# EasyEDA schematic SCH_micro65_2023-10-09.json
TITLE: Micro65; REV: 0.7; Date: 2023-10-05; Sheet: 1/1; Drawn By: wynnfarr62; Company: Wynn Makes Things
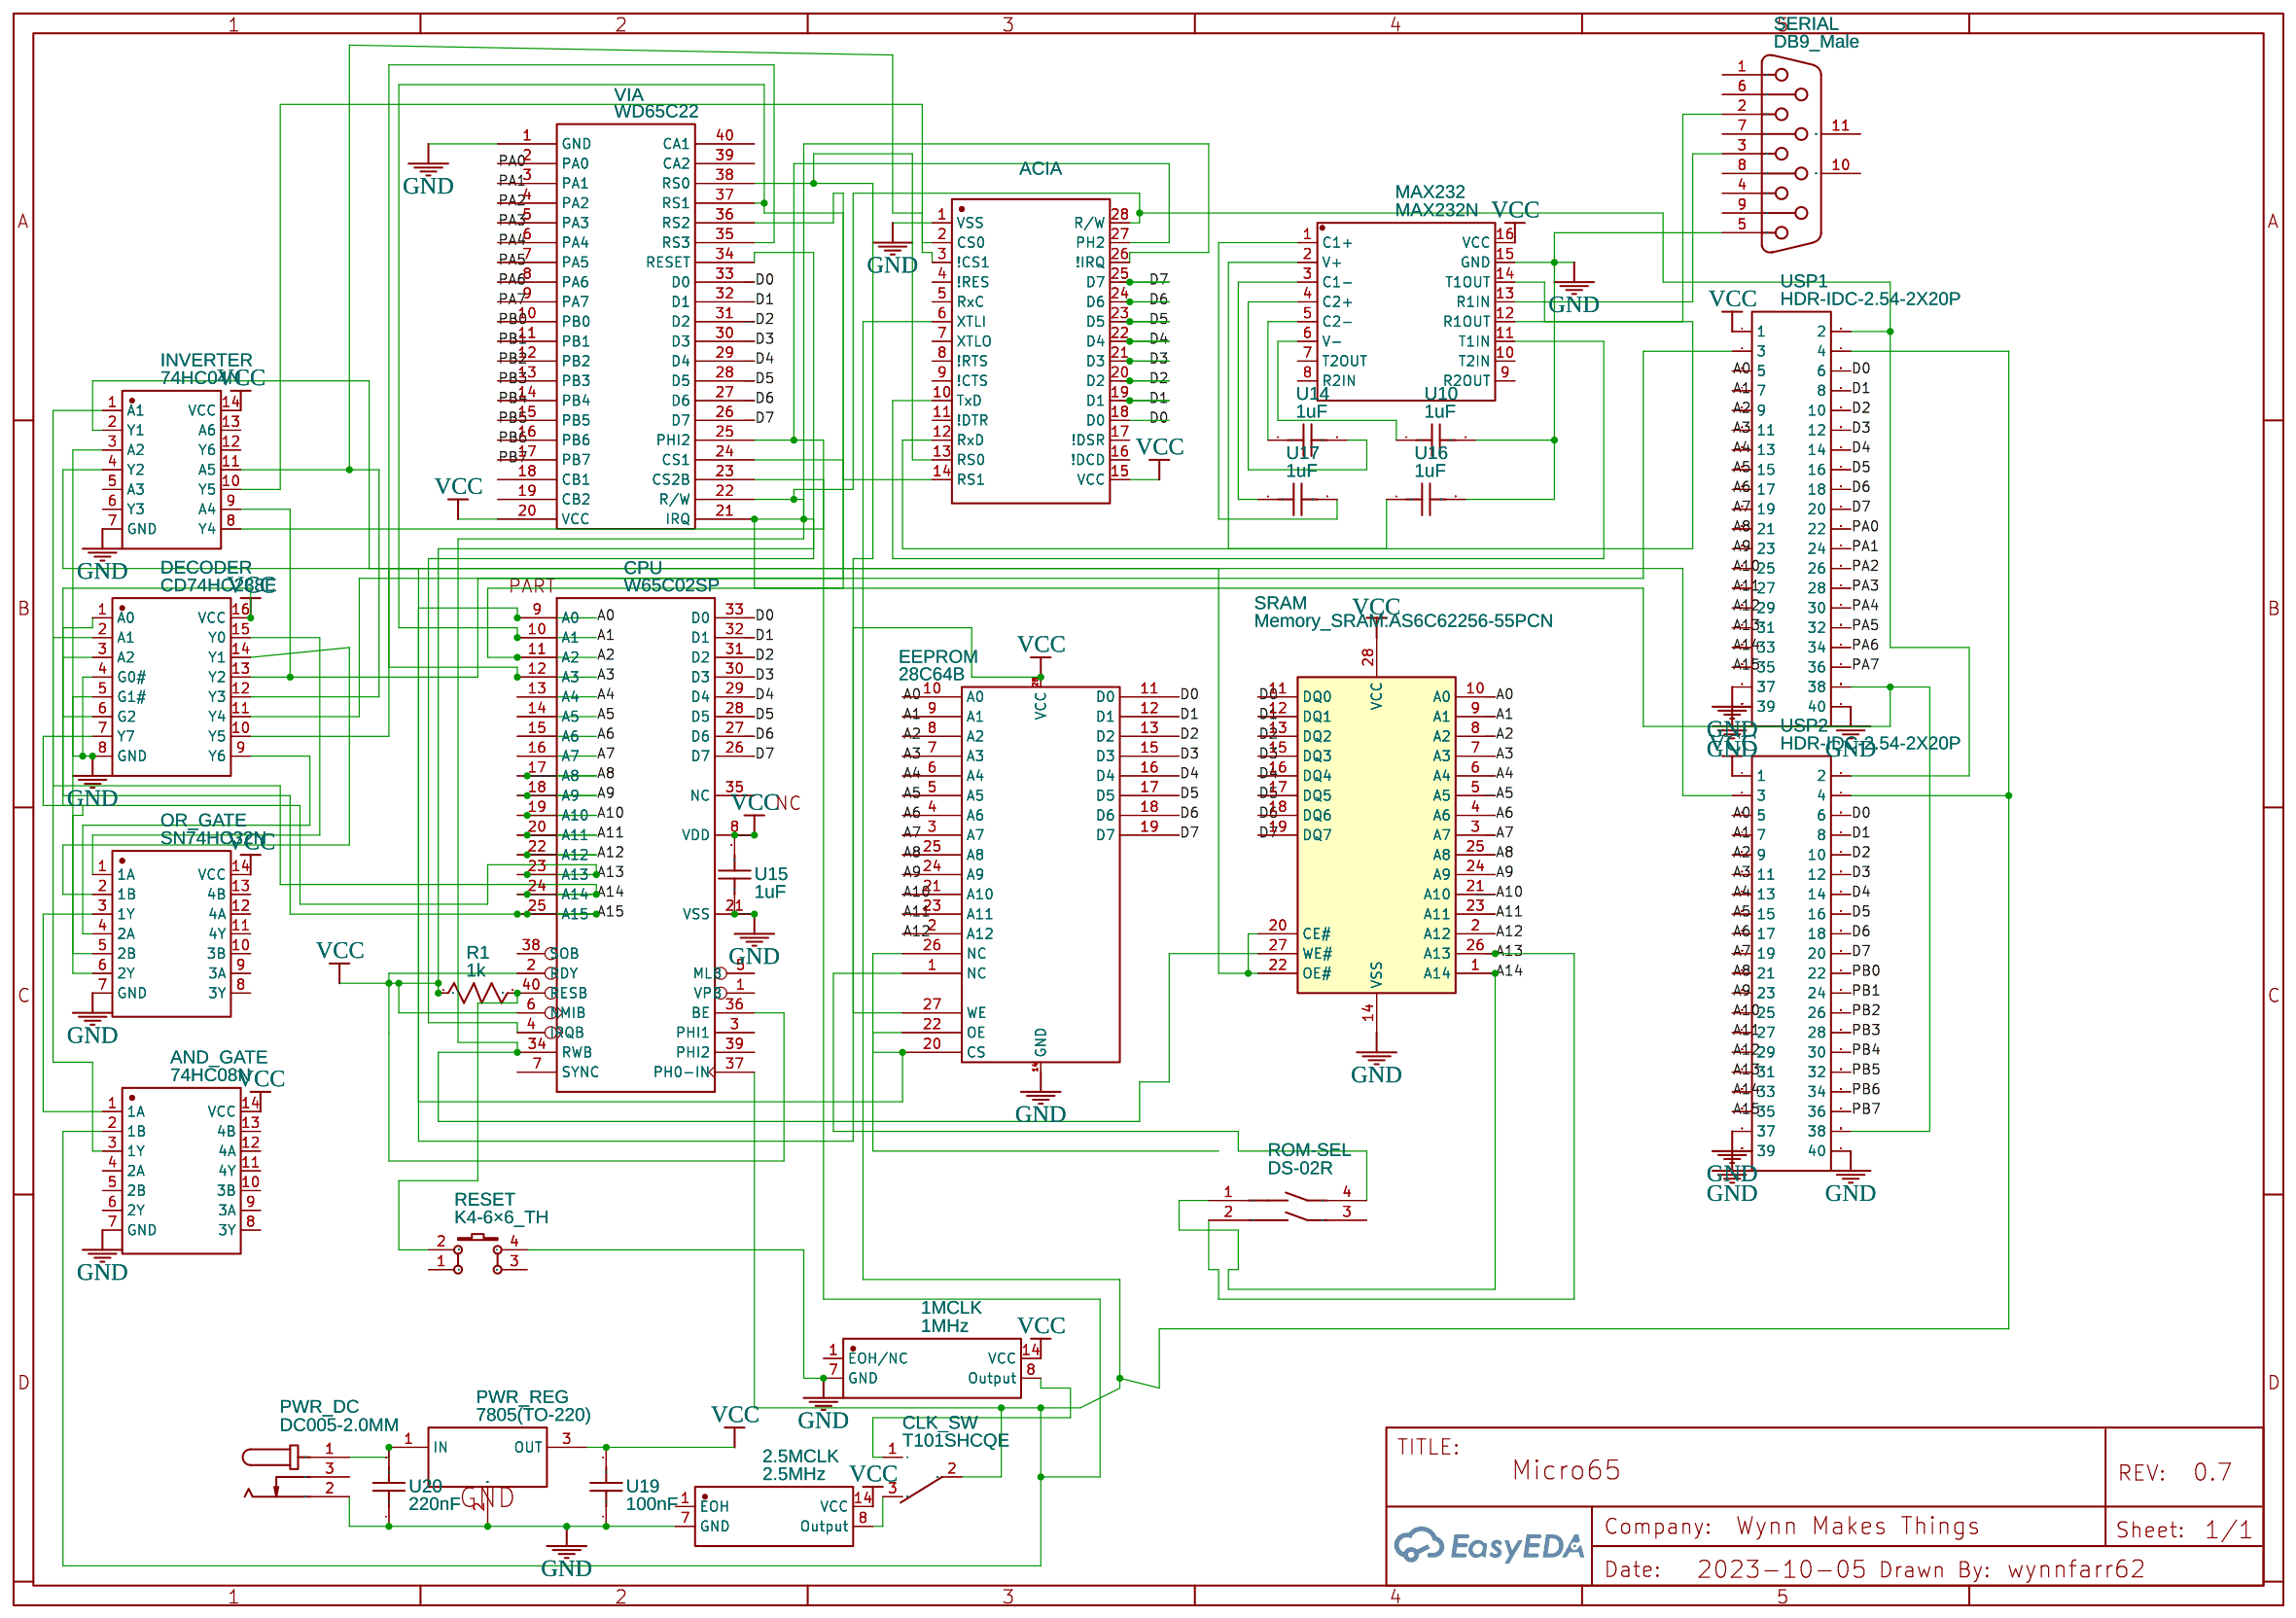
[diagram p0: schematic sheet]

## Parts
1MCLK  1MHz  [OSC-TH_4P-L20.8-W13.2-P15.24-BL]
2.5MCLK  2.5MHz  [OSC-TH_4P-L20.8-W13.2-P15.24-BL]
ACIA  NO  [DIP-28_L36.8-W13.9-P2.54-LS15.2-BL]
AND_GATE  74HC08N  [PDIP-14_L19.3-W6.5-P2.54-LS7.6-BL]
CLK_SW  T101SHCQE  [SW-TH_T101SHCQE]
CPU  W65C02SP  [DIP-40_L52.3-W13.9-P2.54-LS15.2-BL-BASE]
DECODER  CD74HC238E  [PDIP-16_L19.3-W6.4-P2.54-LS7.9-BL]
EEPROM  28C64B  [DIP-28_L36.8-W13.9-P2.54-LS15.2-BL]
INVERTER  74HC04N  [DIP-14_L19.4-W6.4-P2.54-LS7.6-BL]
MAX232  MAX232N  [PDIP-16_L19.7-W6.6-P2.54-LS7.8-BL]
OR_GATE  SN74HC32N  [DIP-14_L19.0-W7.0-P2.54-LS7.6-BL]
PWR_DC  DC005-2.0MM  [DC-IN-TH_DC005]
PWR_REG  7805(TO-220)  [TO-220-3_L10.0-W4.5-P2.54-L]
R1  1k  [R_AXIAL-0.3]
RESET  K4-6×6_TH  [KEY-TH_4P-L6.0-W6.0-P4.50-LS6.5]
ROM-SEL  DS-02R  [SW-TH_4P-P2.54_DS-02R]
SERIAL  DB9_Male  [DSUB-TH_DMR-9P]
SRAM  Memory_SRAM:AS6C62256-55PCN  [DIP-28_L36.8-W13.9-P2.54-LS15.2-BL]
U10  1uF  [CAP-TH_L4.0-W2.5-P5.00-D0.5]
U14  1uF  [CAP-TH_L4.0-W2.5-P5.00-D0.5]
U15  1uF  [CAP-TH_L4.0-W2.5-P5.00-D0.5]
U16  1uF  [CAP-TH_L4.0-W2.5-P5.00-D0.5]
U17  1uF  [CAP-TH_L4.0-W2.5-P5.00-D0.5]
U19  100nF  [CAP-TH_L7.2-W2.5-P5.00-D1.0]
U20  220nF  [CAP-TH_L7.2-W2.5-P5.00-D0.5]
USP1  HDR-IDC-2.54-2X20P  [IDC-TH_40P-P2.54_C9138]
USP2  HDR-IDC-2.54-2X20P  [IDC-TH_40P-P2.54_C9138]
VIA  WD65C22  [DIP-40_L52.3-W13.9-P2.54-LS15.2-BL-BASE]

## Library data of the parts
1MCLK = MXO45T-2C-1M000000: Contributor: lcsc; Supplier: LCSC; Supplier Part: C1138959; Manufacturer: CTS(西迪斯); JLCPCB Part Class: Extended Part; link: https://lcsc.com/eda_search?q=C1138959&%26type=1&ref=editor
2.5MCLK = MXO45HST-2I-2M500000: Contributor: lcsc; Supplier: LCSC; Supplier Part: C1138640; Manufacturer: CTS(西迪斯); JLCPCB Part Class: Extended Part; link: https://lcsc.com/eda_search?q=C1138640&%26type=1&ref=editor
ACIA = R6551
AND_GATE = 74HC08N: Contributor: lcsc; Supplier: LCSC; Supplier Part: C5116331; Manufacturer: HGSEMI(华冠); link: https://lcsc.com/eda_search?q=C5116331&%26type=1&ref=editor
CLK_SW = T101SHCQE: Contributor: LCSC; Supplier: LCSC; Supplier Part: C221979; Manufacturer: C&K; JLCPCB Part Class: Extended Part; link: https://lcsc.com/eda_search?q=C221979&%26type=1&ref=editor
DECODER = CD74HC238E: Contributor: LCSC; Supplier: LCSC; Supplier Part: C1547095; Manufacturer: TI(德州仪器); JLCPCB Part Class: Extended Part; link: https://lcsc.com/eda_search?q=C1547095&%26type=1&ref=editor
EEPROM = -: Contributor: KiCAD; license: https://www.gnu.org/licenses/lgpl-2.1.html; Package Display: No
INVERTER = 74HC04N: Contributor: LCSC; Supplier: LCSC; Supplier Part: C507192; Manufacturer: HGSEMI(华冠); JLCPCB Part Class: Extended Part; link: https://lcsc.com/eda_search?q=C507192&%26type=1&ref=editor
MAX232 = MAX232N: Contributor: LCSC; Supplier: LCSC; Supplier Part: C353147; Manufacturer: Texas Instruments; JLCPCB Part Class: Extended Part; link: https://lcsc.com/eda_search?q=C353147&%26type=1&ref=editor
OR_GATE = SN74HC32N: Supplier: LCSC; Manufacturer: TI(德州仪器); Supplier Part: C2894; JLCPCB Part Class: Extended Part; link: https://lcsc.com/eda_search?q=C2894&%26type=1&ref=editor
PWR_DC = DC005-2.0MM: Supplier: LCSC; Manufacturer: SOFNG; Supplier Part: C111567
PWR_REG = 7805(TO-220): Supplier: LCSC; Manufacturer: STMicroelectronics; Manufacturer Part: L7805CV-DG; Supplier Part: C3795; Contributor: LCEDA_Lib
R1 = R_AXIAL-0.3_US: Contributor: LCEDA_Lib
RESET = K4-6×6_TH: Supplier: LCSC; Supplier Part: C136684; Manufacturer: 韩国韩荣; Manufacturer Part: K2-1102DP-E4SW-04; Contributor: LCEDA_Lib
ROM-SEL = DS-02R: Contributor: lcsc; Supplier: LCSC; Supplier Part: C2985910; Manufacturer: SM Switch; link: https://lcsc.com/eda_search?q=C2985910&%26type=1&ref=editor
SERIAL = DB9_Male: Supplier Part: C185657; Supplier: LCSC; Manufacturer: Amphenol; Contributor: LCEDA_Lib
SRAM = -: Contributor: P Garrity
U10 U14-U17 = FK28X5R1E105KR000: Contributor: lcsc; Supplier: LCSC; Supplier Part: C3695773; Manufacturer: TDK; link: https://lcsc.com/eda_search?q=C3695773&%26type=1&ref=editor
U19 = MEB104J63V82CB0236: Contributor: lcsc; Supplier: LCSC; Supplier Part: C3034535; Manufacturer: KNSCHA(科尼盛); link: https://lcsc.com/eda_search?q=C3034535&%26type=1&ref=editor
U20 = C242A224J20C000: Contributor: lcsc; Supplier: LCSC; Supplier Part: C5121934; Manufacturer: faratronic(厦门法拉); link: https://lcsc.com/eda_search?q=C5121934&%26type=1&ref=editor
USP1 USP2 = HDR-IDC-2.54-2X20P: Supplier: LCSC; Manufacturer: BOOMELE; Manufacturer Part: IDC Box 2X20 2.54MM; image: //image.lceda.cn/szlcsc/C9138.jpg; Supplier Part: C9138
VIA = -: Contributor: Guki

## Nets
GND: 1MCLK.7(GND) 2.5MCLK.7(GND) ACIA.1(VSS) AND_GATE.7(GND) CPU.21(VSS) DECODER.4(G0#) DECODER.5(G1#) DECODER.8(GND) EEPROM.14(GND) INVERTER.7(GND) MAX232.15(GND) OR_GATE.7(GND) PWR_DC.2 PWR_REG.2(GND) RESET.4 SERIAL.5 SRAM.14(VSS) U10.2 U15.1 U16.2 U19.1 U20.1 USP1.37 USP1.39 USP1.40 USP2.37 USP2.39 USP2.40 VIA.1(GND)
VCC: 1MCLK.14(VCC) 2.5MCLK.14(VCC) ACIA.15(VCC) AND_GATE.14(VCC) CPU.2(RDY) CPU.6(NMIB) CPU.8(VDD) CPU.36(BE) DECODER.6(G2) DECODER.16(VCC) EEPROM.27(WE) EEPROM.28(VCC) INVERTER.14(VCC) MAX232.16(VCC) OR_GATE.14(VCC) PWR_REG.3(OUT) R1.1 SRAM.28(VCC) U15.2 U19.2 USP1.1 USP2.1 VIA.20(VCC) VIA.34(RESET)
A0: ACIA.13(RS0) CPU.9(A0) EEPROM.10(A0) SRAM.10(A0) USP1.5 USP2.5 VIA.38(RS0)
A1: ACIA.14(RS1) CPU.10(A1) EEPROM.9(A1) SRAM.9(A1) USP1.7 USP2.7 VIA.37(RS1)
A2: CPU.11(A2) EEPROM.8(A2) SRAM.8(A2) USP1.9 USP2.9 VIA.36(RS2)
A3: CPU.12(A3) EEPROM.7(A3) SRAM.7(A3) USP1.11 USP2.11 VIA.35(RS3)
A4: CPU.13(A4) EEPROM.6(A4) SRAM.6(A4) USP1.13 USP2.13
A5: CPU.14(A5) EEPROM.5(A5) SRAM.5(A5) USP1.15 USP2.15
A6: CPU.15(A6) EEPROM.4(A6) SRAM.4(A6) USP1.17 USP2.17
A7: CPU.16(A7) EEPROM.3(A7) SRAM.3(A7) USP1.19 USP2.19
A8: CPU.17(A8) EEPROM.25(A8) SRAM.25(A8) USP1.21 USP2.21
A9: CPU.18(A9) EEPROM.24(A9) SRAM.24(A9) USP1.23 USP2.23
A10: CPU.19(A10) EEPROM.21(A10) SRAM.21(A10) USP1.25 USP2.25
A11: CPU.20(A11) EEPROM.23(A11) SRAM.23(A11) USP1.27 USP2.27
A12: CPU.22(A12) EEPROM.2(A12) SRAM.2(A12) USP1.29 USP2.29
A13: CPU.23(A13) DECODER.1(A0) ROM-SEL.2 SRAM.26(A13) USP1.31 USP2.31
A14: CPU.24(A14) DECODER.2(A1) ROM-SEL.1 SRAM.1(A14) USP1.33 USP2.33
A15: CPU.25(A15) DECODER.3(A2) USP1.35 USP2.35
D0: ACIA.18(D0) CPU.33(D0) EEPROM.11(D0) SRAM.11(DQ0) USP1.6 USP2.6 VIA.33(D0)
D1: ACIA.19(D1) CPU.32(D1) EEPROM.12(D1) SRAM.12(DQ1) USP1.8 USP2.8 VIA.32(D1)
D2: ACIA.20(D2) CPU.31(D2) EEPROM.13(D2) SRAM.13(DQ2) USP1.10 USP2.10 VIA.31(D2)
D3: ACIA.21(D3) CPU.30(D3) EEPROM.15(D3) SRAM.15(DQ3) USP1.12 USP2.12 VIA.30(D3)
D4: ACIA.22(D4) CPU.29(D4) EEPROM.16(D4) SRAM.16(DQ4) USP1.14 USP2.14 VIA.29(D4)
D5: ACIA.23(D5) CPU.28(D5) EEPROM.17(D5) SRAM.17(DQ5) USP1.16 USP2.16 VIA.28(D5)
D6: ACIA.24(D6) CPU.27(D6) EEPROM.18(D6) SRAM.18(DQ6) USP1.18 USP2.18 VIA.27(D6)
D7: ACIA.25(D7) CPU.26(D7) EEPROM.19(D7) SRAM.19(DQ7) USP1.20 USP2.20 VIA.26(D7)
PA0: USP1.22 VIA.2(PA0)
PA1: USP1.24 VIA.3(PA1)
PA2: USP1.26 VIA.4(PA2)
PA3: USP1.28 VIA.5(PA3)
PA4: USP1.30 VIA.6(PA4)
PA5: USP1.32 VIA.7(PA5)
PA6: USP1.34 VIA.8(PA6)
PA7: USP1.36 VIA.9(PA7)
PB0: USP2.22 VIA.10(PB0)
PB1: USP2.24 VIA.11(PB1)
PB2: USP2.26 VIA.12(PB2)
PB3: USP2.28 VIA.13(PB3)
PB4: USP2.30 VIA.14(PB4)
PB5: USP2.32 VIA.15(PB5)
PB6: USP2.34 VIA.16(PB6)
PB7: USP2.36 VIA.17(PB7)
Net-(1MCLK-8): 1MCLK.8(Output) CLK_SW.1
Net-(2.5MCLK-8): 2.5MCLK.8(Output) CLK_SW.3
Net-(ACIA-2): ACIA.2(CS0) DECODER.12(Y3) INVERTER.11(A5)
Net-(ACIA-3): ACIA.3(!CS1) INVERTER.10(Y5)
Net-(ACIA-6): ACIA.6(XTLI) ACIA.27(PH2) AND_GATE.2(1B) CLK_SW.2 CPU.37(PH0-IN) USP1.4 USP2.4 VIA.25(PHI2)
Net-(ACIA-10): ACIA.10(TxD) MAX232.11(T1IN)
Net-(ACIA-12): ACIA.12(RxD) MAX232.12(R1OUT)
Net-(ACIA-26): ACIA.26(!IRQ) ACIA.28(R/W) CPU.4(IRQB) CPU.34(RWB) SRAM.27(WE#) USP1.2 USP1.38 USP2.2 USP2.38 VIA.21(IRQ) VIA.22(R/W)
Net-(AND_GATE-1): AND_GATE.1(1A) OR_GATE.3(1Y)
Net-(AND_GATE-3): AND_GATE.3(1Y) INVERTER.1(A1)
Net-(CPU-40): CPU.40(RESB) R1.2 RESET.2
Net-(DECODER-7): DECODER.7(Y7) OR_GATE.5(2B)
Net-(DECODER-9): DECODER.9(Y6) OR_GATE.4(2A)
Net-(DECODER-10): DECODER.10(Y5) USP2.3
Net-(DECODER-11): DECODER.11(Y4) USP1.3
Net-(DECODER-13): DECODER.13(Y2) INVERTER.9(A4) VIA.24(CS1)
Net-(DECODER-14): DECODER.14(Y1) OR_GATE.2(1B)
Net-(DECODER-15): DECODER.15(Y0) OR_GATE.1(1A)
Net-(EEPROM-1): EEPROM.1(NC) ROM-SEL.4
Net-(EEPROM-20): EEPROM.20(CS) EEPROM.22(OE) INVERTER.4(Y2)
Net-(INVERTER-2): INVERTER.2(Y1) SRAM.20(CE#) SRAM.22(OE#)
Net-(INVERTER-3): INVERTER.3(A2) OR_GATE.6(2Y)
Net-(INVERTER-8): INVERTER.8(Y4) VIA.23(CS2B)
Net-(MAX232-1): MAX232.1(C1+) U17.2
Net-(MAX232-2): MAX232.2(V+) U16.1
Net-(MAX232-3): MAX232.3(C1-) U17.1
Net-(MAX232-4): MAX232.4(C2+) U14.2
Net-(MAX232-5): MAX232.5(C2-) U14.1
Net-(MAX232-6): MAX232.6(V-) U10.1
Net-(MAX232-13): MAX232.13(R1IN) SERIAL.3
Net-(MAX232-14): MAX232.14(T1OUT) SERIAL.2
Net-(PWR_DC-1): PWR_DC.1 PWR_REG.1(IN) U20.2

Not connected (* = marked no-connect by the designer): 1MCLK 1(EOH/NC); 2.5MCLK 1(EOH); ACIA 4(!RES) 5(RxC) 7(XTLO) 8(!RTS) 9(!CTS) 11(!DTR) 16(!DCD) 17(!DSR); AND_GATE 4(2A) 5(2B) 6(2Y) 8(3Y) 9(3A) 10(3B) 11(4Y) 12(4A) 13(4B); CPU 1(VPB) 3(PHI1) 5(MLB) 7(SYNC) 35(NC) 38(SOB) 39(PHI2); EEPROM 26(NC); INVERTER 5(A3) 6(Y3) 12(Y6) 13(A6); MAX232 7(T2OUT) 8(R2IN) 9(R2OUT) 10(T2IN); OR_GATE 8(3Y) 9(3A) 10(3B) 11(4Y) 12(4A) 13(4B); PWR_DC 3; RESET 1 3; ROM-SEL 3; SERIAL 1 4 6 7 8 9 10(MH1) 11(MH2); VIA 18(CB1) 19(CB2) 39(CA2) 40(CA1)
